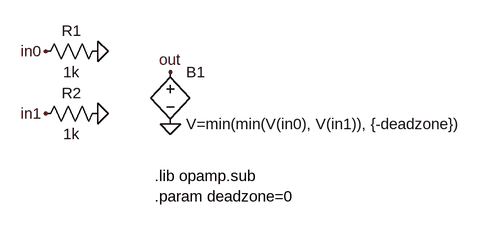
[diagram p0: schematic min.asc]
min.asc, the LTspice schematic file:
Version 4
SHEET 1 880 680
FLAG 32 32 in0
FLAG 112 32 0
FLAG 32 128 in1
FLAG 112 128 0
FLAG 224 144 0
FLAG 224 64 out
SYMBOL res 128 16 R90
WINDOW 0 0 56 VBottom 2
WINDOW 3 32 56 VTop 2
SYMATTR InstName R1
SYMATTR Value 1k
SYMBOL res 128 112 R90
WINDOW 0 0 56 VBottom 2
WINDOW 3 32 56 VTop 2
SYMATTR InstName R2
SYMATTR Value 1k
SYMBOL bv 224 48 R0
SYMATTR InstName B1
SYMATTR Value V=min(min(V(in0), V(in1)), {-deadzone})
TEXT 200 224 Left 2 !.lib opamp.sub\n.param deadzone=0

The netlist it stands for:
* min.asc
R1 0 in0 1k
R2 0 in1 1k
B1 out 0 V=min(min(V(in0), V(in1)), {-deadzone})
.lib opamp.sub
.param deadzone=0
.backanno
.end